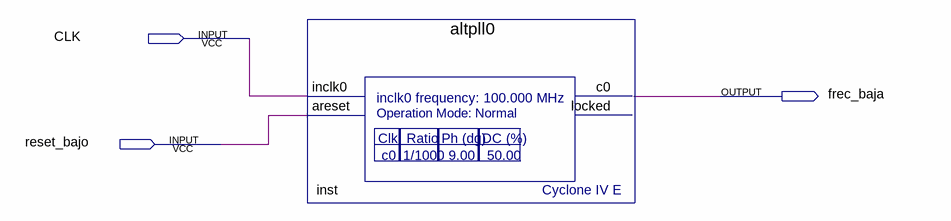
[diagram p0: schematic sheet]
// Quartus schematic pll.bdf as structural Verilog: 1 symbols, 3 pins
module pll (
  input  CLK,
  input  reset_bajo,
  output frec_baja
);

  altpll0 inst (.inclk0(CLK), .areset(reset_bajo), .c0(frec_baja));  // open: locked
endmodule
